# Altium schematic sheet switch_final.SchDoc
size A4; SheetNumber: 3; SheetTotal: 3
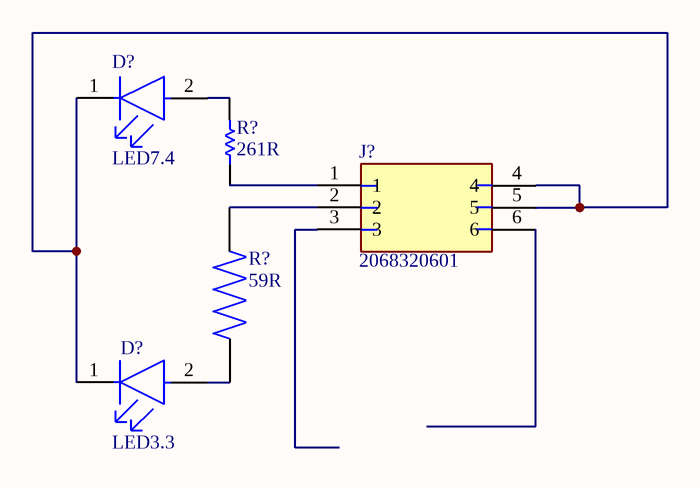
[diagram p0: switch_final.SchDoc]

## Parts
(Parts that share a designator on the sheet are numbered #1, #2 ... from top to bottom, then left to right.)
D?#1  LED7.4  [FP-APHHS1005CGCK-MFG]
D?#2  LED3.3  [FP-APHHS1005CGCK-MFG]
J?  2068320601  [MOLEX_2068320601]
R?#1  261R  [RESC3216X70X50NL05T20]
R?#2  59R  [RES_ERJP06F59R0V]

## Nets
NetD?#1_1: D?#1.1(C) D?#2.1(C) J?.4 J?.5
NetD?#1_2: D?#1.2(A) R?#1.2
NetD?#2_2: D?#2.2(A) R?#2.1
NetJ?_1: J?.1 R?#1.1
NetJ?_2: J?.2 R?#2.2

Not connected (* = marked no-connect by the designer): J? 3 6

## Library data of the parts
D?#1 D?#2 = CMP-44529-000044-1: LED GREEN CLEAR CHIP SMD; Viewing Angle: 120°; Dominant Wavelength: 570nm; Test Current: 20mA; Luminous Intensity: 50mcd; Forward Voltage: 2.1V; Number of LEDs: 1; Lens Color: Clear; Packaging: Tape and Reel; Max Operating Temperature: 85°C; Illumination Color: Green; Length: 1mm; Mount: Surface Mount; Lens Style: Clear; Color: Green; Number of Pins: 2; Wavelength: 570nm; Case/Package: 0402; Width: 0.5mm; Package Quantity: 2000; Case Code (Metric): 1005; Height: 0.6mm; Lead Free: Lead Free; Case Code (Imperial): 0402; Forward Current: 20mA; Min Operating Temperature: -40°C
R?#1 = CMP-2003-00255-1: Manufacturer: Panasonic; Part Number: ERJ-8ENF2610V
R?#2 = ERJP06F59R0V: Package: None; MP: ERJP06F59R0V; Value: *; Price: None; Availability: Unavailable
J? = 2068320601: Value: *; MP: 2068320601; Package: None; Price: None; Availability: Unavailable